# EAGLE schematic 240x240_v3 (EAGLE 9.6.2)
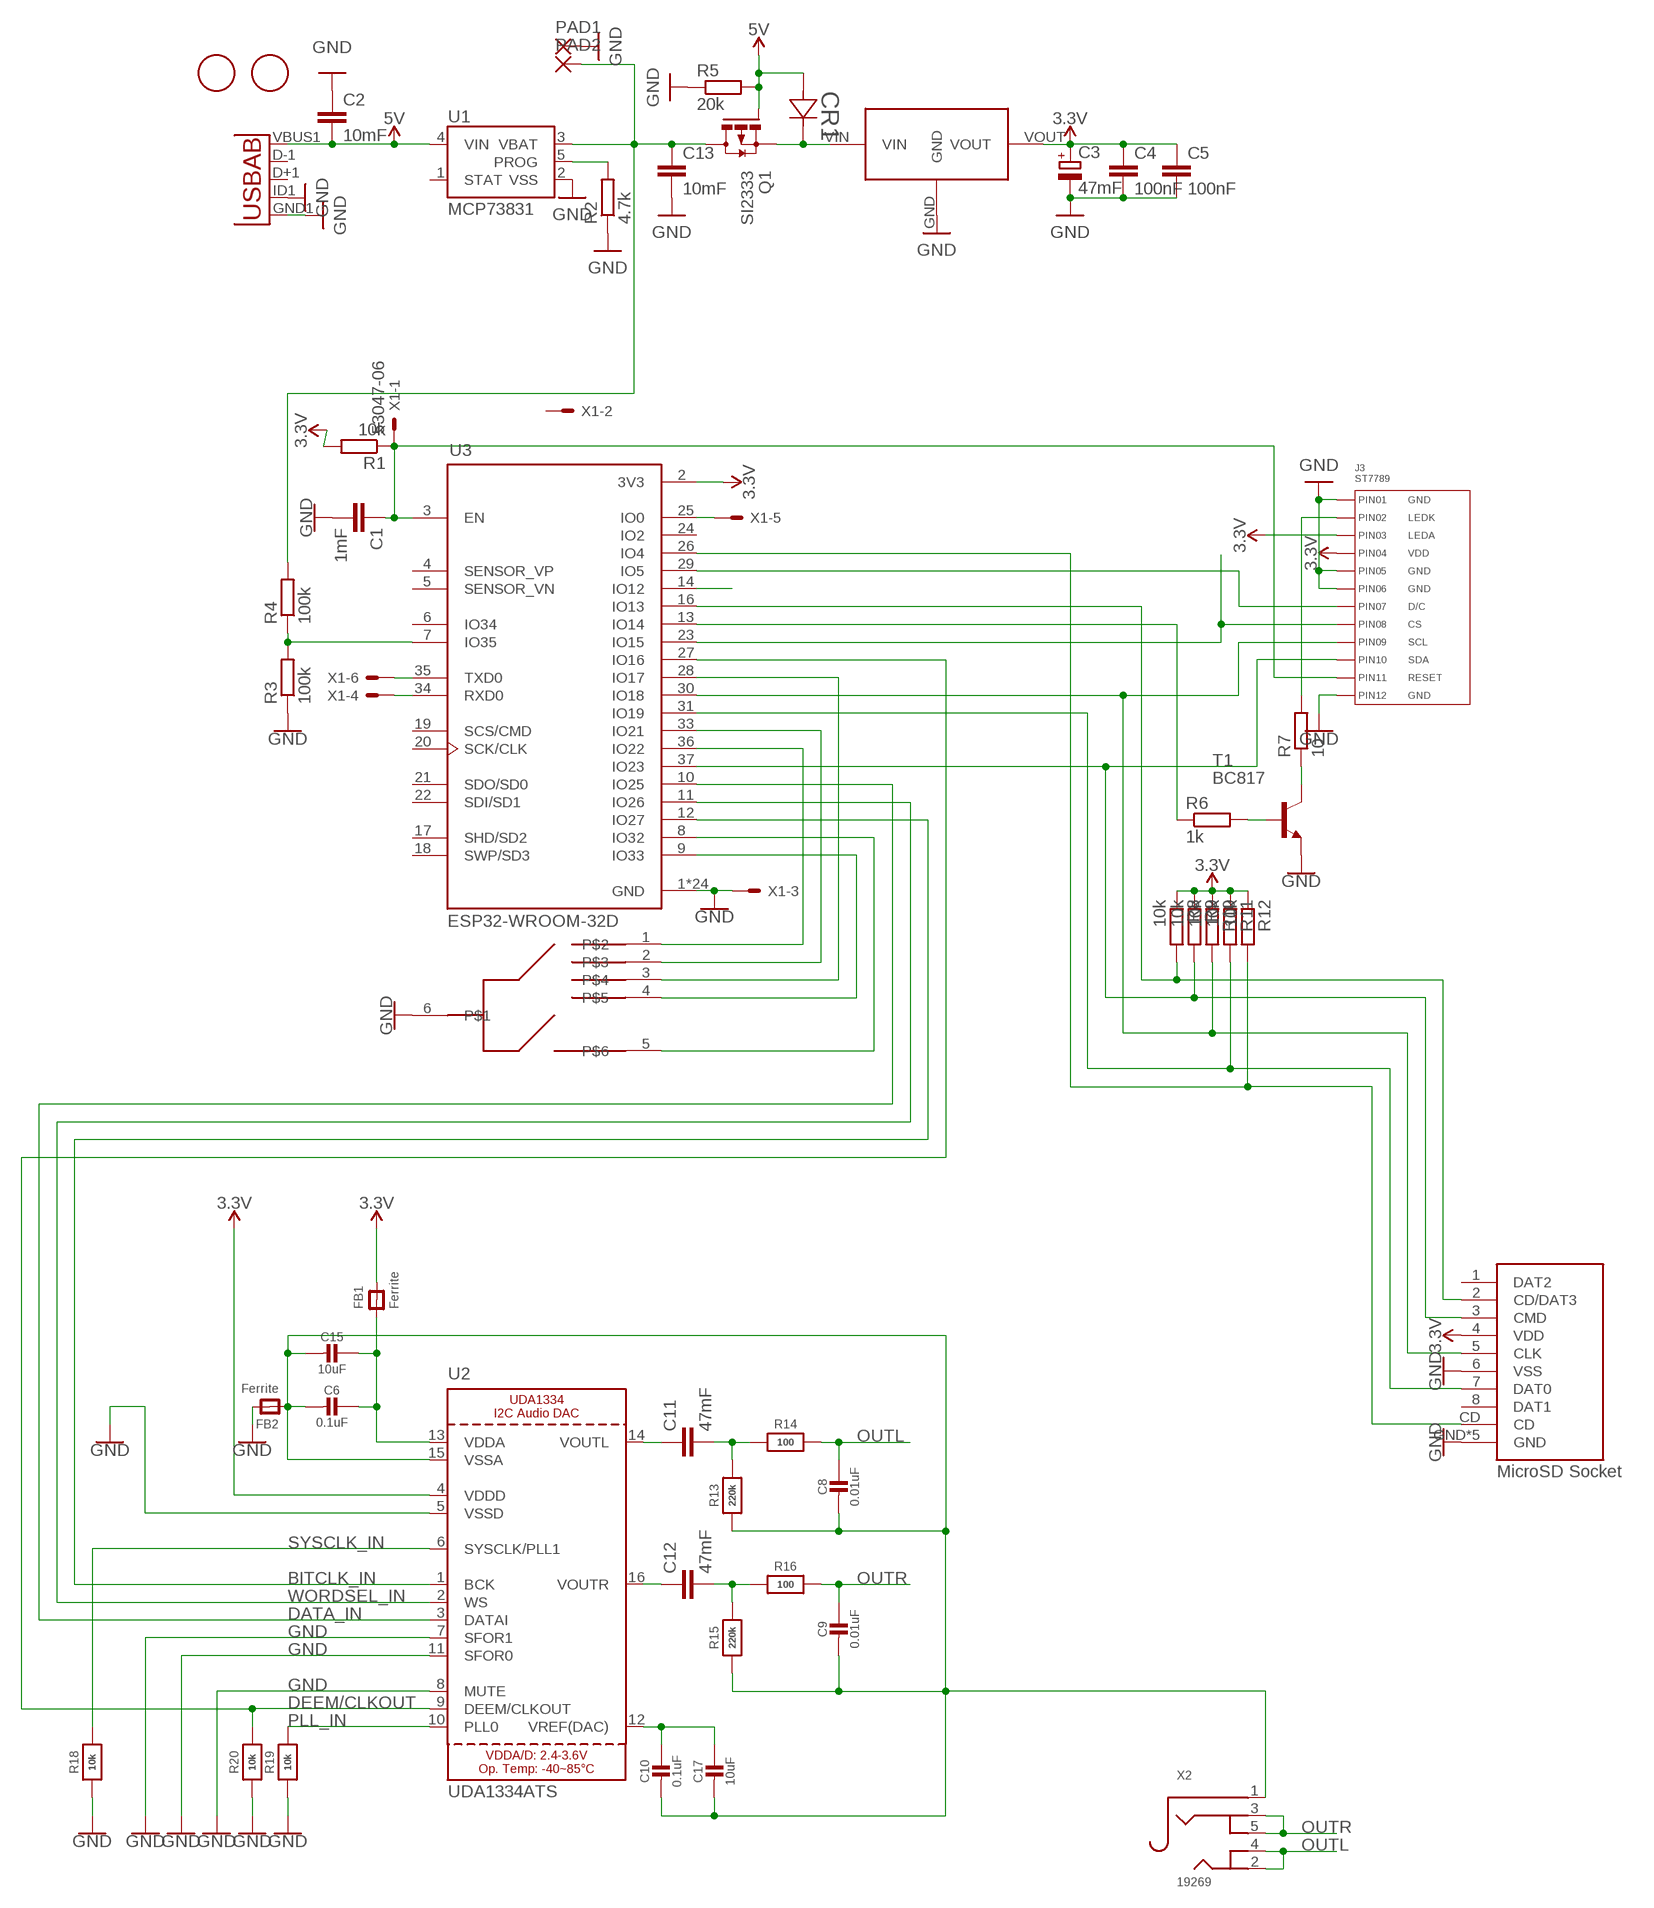
[diagram p0: schematic, sheet 1]

## Parts
C1  1mF  C-EUC0603  [C0603]
C2  10mF  C-EUC0603  [C0603]
C3  47mF  CPOL-EUSMCB  [SMC_B]
C4  100nF  C-EUC0805K  [C0805K]
C5  100nF  C-EUC0805K  [C0805K]
C6  0.1uF  CAP_CERAMIC0805-NOOUTLINE  [0805-NO]
C8  0.01uF  CAP_CERAMIC0805-NOOUTLINE  [0805-NO]
C9  0.01uF  CAP_CERAMIC0805-NOOUTLINE  [0805-NO]
C10  0.1uF  CAP_CERAMIC0805-NOOUTLINE  [0805-NO]
C11  47mF  C-EUC1210  [C1210]
C12  47mF  C-EUC1210  [C1210]
C13  10mF  C-EUC0603  [C0603]
C15  10uF  CAP_CERAMIC0805-NOOUTLINE  [0805-NO]
C17  10uF  CAP_CERAMIC0805-NOOUTLINE  [0805-NO]
CR1  BAT48  BAT48ZFILMSOD-123_STM-M  [SOD-123_STM-M]
FB1  Ferrite  FERRITE0805  [0805]
FB2  Ferrite  FERRITE0805  [0805]
J3  ST7789  CON_01X12_ST7789_CONNECTOR  [ST7789_CONNECTOR]
PAD1  SMD2  [SMD1,27-2,54]
PAD2  SMD2  [SMD1,27-2,54]
Q1  SI2333  FDN360P  [SUPER-SOT3]
R1  10k  R-EU_R0603  [R0603]
R2  4.7k  R-EU_R0603  [R0603]
R3  100k  R-EU_R0805  [R0805]
R4  100k  R-EU_R0805  [R0805]
R5  20k  R-EU_R0603  [R0603]
R6  1k  R-EU_R0603  [R0603]
R7  10  R-EU_R0805  [R0805]
R8  10k  R-EU_R0603  [R0603]
R9  10k  R-EU_R0603  [R0603]
R10  10k  R-EU_R0603  [R0603]
R11  10k  R-EU_R0603  [R0603]
R12  10k  R-EU_R0603  [R0603]
R13  220k  RESISTOR0805_NOOUTLINE  [0805-NO]
R14  100  RESISTOR0805_NOOUTLINE  [0805-NO]
R15  220k  RESISTOR0805_NOOUTLINE  [0805-NO]
R16  100  RESISTOR0805_NOOUTLINE  [0805-NO]
R18  10k  RESISTOR_0603_NOOUT  [0603-NO]
R19  10k  RESISTOR_0603_NOOUT  [0603-NO]
R20  10k  RESISTOR_0603_NOOUT  [0603-NO]
T1  BC817  BC817-16-NPN-SOT23-BEC  [SOT23-BEC]
U1  MCP73831  [SOT23-5]
U2  UDA1334ATS  AUDIO_I2S_UDA1334""  [SSOP16_4.4MM]
U3  ESP32-WROOM-32D  [MODULE_ESP32-WROOM-32D]
U4  USB""  [USB-MICRO-SMD]
U$1  XC6203  HT7333  [SOT89]
U$2  B5-P5S-0D  [B5-P5S-0D-Z]
U$3  FIDUCIAL  [FIDUCIAL_1MM]
U$4  FIDUCIAL  [FIDUCIAL_1MM]
U$5  ATTEND_MICROSD_SOCKET  [ATTEND_MICROSD_SOCKET]
X1  53047-06  [53047-06]
X2  19269  AUDIO_3.5MMJACK  [4UCONN_19269]

## Nets
3.3V [Power]: C3.+ C4.1 C5.1 FB1.2 J3.P$3 J3.P$4 R1.2 R8.1 R9.1 R10.1 R11.1 R12.1 U2.4(VDDD) U3.2(3V3) U$1.VOUT U$5.4(VDD)
5V [Power]: C2.2 CR1.1 Q1.1(G) R5.2 U1.4(VIN) U4.VBUS1(VBUS)
BITCLK_IN: U2.1(BCK) U3.12(IO27)
DATA_IN: U2.3(DATAI) U3.10(IO25)
DEEM/CLKOUT: R20.2 U2.9(DEEM/CLKOUT) U3.27(IO16)
GND [Power]: C1.2 C2.1 C3.- C4.2 C5.2 C13.2 FB2.2 J3.P$1 J3.P$5 J3.P$6 J3.P$12 PAD1.1(P) R2.1 R3.1 R5.1 R18.1 R19.1 R20.1 T1.E U1.2(VSS) U2.5(VSSD) U2.7(SFOR1) U2.8(MUTE) U2.11(SFOR0) U3.1(GND) U3.15(GND) U3.38(GND) U3.39_1(GND) U3.39_2(GND) U3.39_3(GND) U3.39_4(GND) U3.39_5(GND) U3.39_6(GND) U3.39_7(GND) U3.39_8(GND) U3.39_9(GND) U3.39_10(GND) U3.39_11(GND) U3.39_12(GND) U3.39_13(GND) U3.39_14(GND) U3.39_15(GND) U3.39_16(GND) U3.39_17(GND) U3.39_18(GND) U3.39_19(GND) U3.39_20(GND) U3.39_21(GND) U4.GND1(GND) U4.ID1(USBID) U$1.GND U$2.6 U$5.6(VSS) U$5.GND U$5.GND2(GND) U$5.GND3(GND) U$5.GND4(GND) U$5.GND5(GND) X1.3
N$1: C1.1 J3.P$11 R1.1 U3.3(EN) X1.1
N$2: J3.P$9 R10.2 U3.30(IO18) U$5.5(CLK)
N$3: J3.P$10 R9.2 U3.37(IO23) U$5.3(CMD)
N$4: U3.14(IO12)
N$5: J3.P$7 U3.29(IO5)
N$6: J3.P$8 U3.23(IO15)
N$7: U3.35(TXD0) X1.6
N$8: U3.34(RXD0) X1.4
N$9: R3.2 R4.1 U3.7(IO35)
N$10: R6.2 T1.B
N$11: U3.36(IO22) U$2.1
N$12: R2.2 U1.5(PROG)
N$13: J3.P$2 R7.2
N$14: U3.33(IO21) U$2.2
N$15: U3.28(IO17) U$2.3
N$16: U3.9(IO33) U$2.4
N$17: U3.8(IO32) U$2.5
N$18: R11.2 U3.31(IO19) U$5.7(DAT0)
N$19 [Power]: C13.1 PAD2.1(P) Q1.3(D) R4.2 U1.3(VBAT)
N$20: U3.25(IO0) X1.5
N$21: R7.1 T1.C
N$22: R6.1 U3.13(IO14)
N$23: R8.2 U3.16(IO13) U$5.2(CD/DAT3)
N$24: R12.2 U3.26(IO4) U$5.CD
N$25: C6.1 C15.1 FB1.1 U2.13(VDDA)
N$26: C11.2 R13.2 R14.1
N$27: C12.2 R15.2 R16.1
N$28: C10.1 C17.1 U2.12(VREF(DAC))
N$29: C12.1 U2.16(VOUTR)
N$30: C11.1 U2.14(VOUTL)
N$31: CR1.2 Q1.2(S) U$1.VIN
N$34: C6.2 C8.2 C9.2 C10.2 C15.2 C17.2 FB2.1 R13.1 R15.1 U2.15(VSSA) X2.1
OUTL: C8.1 R14.2 X2.2 X2.4
OUTR: C9.1 R16.2 X2.3 X2.5
PLL_IN: R19.2 U2.10(PLL0)
SYSCLK_IN: R18.2 U2.6(SYSCLK/PLL1)
WORDSEL_IN: U2.2(WS) U3.11(IO26)
Unconnected: U1.1(STAT) U3.4(SENSOR_VP) U3.5(SENSOR_VN) U3.6(IO34) U3.17(SHD/SD2) U3.18(SWP/SD3) U3.19(SCS/CMD) U3.20(SCK/CLK) U3.21(SDO/SD0) U3.22(SDI/SD1) U3.24(IO2) U4.D+1(D+) U4.D-1(D-) U$5.1(DAT2) U$5.8(DAT1) X1.2

## Library data of the parts
C1 C2 C4 C5 C11-C13 = rcl:C-EU: CAPACITOR, European symbol; SPICEPREFIX: C
C3 = rcl:CPOL-EU: POLARIZED CAPACITOR, European symbol; SPICEPREFIX: C
C6 C8-C10 C15 C17 = microbuilder:CAP_CERAMIC: Ceramic Capacitors For new designs, use the packages preceded by an '_' character since they are more reliable: The following footprints should be used on most boards: _0402 - Standard footprint for regular board layouts _0603 - Standard footprint for regular board layouts _0805 - Standard footprint for regular board layouts _1206 - Standard footprint for regular board layouts For extremely tight-pitch boards where space is at a premium, the following 'micro-pitch' footprints can be used (smaller pads, no silkscreen outline, etc.): _0402MP - Micro-pitch footprint for very dense/compact boards _0603MP - Micro-pitch footprint for very dense/compact boards _0805MP - Micro-pitch footprint for very dense/compact boards _1206MP - Micro-pitch footprint for very dense/compact boards
CR1 = BAT48:BAT48ZFILM; COPYRIGHT: Copyright (C) 2021 Ultra Librarian. All rights reserved.; MANUFACTURER_PART_NUMBER: BAT48ZFILM; MFR_NAME: STMicroelectronics
FB1 FB2 = microbuilder:FERRITE: Ferrite Bead 0603 MMZ1608B121C - 120 Ohm @ 100MHz, 600mA, 0.15 Ohm DC Resistance - Digikey: 445-2164-1-ND BK1608HW121-T - 120 Ohm, 600mA Ferrite Chip - Digikey: 587-1876-2-ND 0805 HZ0805B272R-10 - 2.7K Ohm @ 100MHz, 200mA, 0.8 Ohm DC Resistance - Digikey: 240-2504-1-ND (see also Murata BLM21BD272SN1L) MMZ2012Y152B - 1.5K Ohm @ 100MHz, 500mA, 0.4 Ohm DC Resistance - Digikey: 445-1560-1-ND - Mainly for high frequency (80-400MHz) MMZ2012R102A - 1K Ohm @ 100MHz, 500mA, 0.3 Ohm DC Resistance - Digikey: 445-1555-2-ND - More general purpose (10-200MHz)
J3 = PP_Connectors:CON_01X12; LABEL01: GND; LABEL02: LEDK; LABEL03: LEDA; LABEL04: VDD; LABEL05: GND; LABEL06: GND; LABEL07: D/C; LABEL08: CS; LABEL09: SCL; LABEL10: SDA; LABEL11: RESET; LABEL12: GND; POPULATE: 0
PAD1 PAD2 = wirepad:SMD2: SMD PAD
Q1 = transistor-power:FDN360P: Single P-Channel, PowerTrench (R) MOSFET Source: http://www.fairchildsemi.com/ds/FD/FDN360P.pdf
R1-R12 = rcl:R-EU_: RESISTOR, European symbol; SPICEPREFIX: R
R13-R16 R18-R20 = microbuilder:RESISTOR: Resistors For new designs, use the packages preceded by an '_' character since they are more reliable: The following footprints should be used on most boards: _0402 - Standard footprint for regular board layouts _0603 - Standard footprint for regular board layouts _0805 - Standard footprint for regular board layouts _1206 - Standard footprint for regular board layouts For extremely tight-pitch boards where space is at a premium, the following 'micro-pitch' footprints can be used (smaller pads, no silkscreen outline, etc.): _0402MP - Micro-pitch footprint for very dense/compact boards _0603MP - Micro-pitch footprint for very dense/compact boards _0805MP - Micro-pitch footprint for very dense/compact boards _1206MP - Micro-pitch footprint for very dense/compact boards
T1 = transistor:*-NPN-: NPN Transistror BF959 corrected 2008.03.06
U1 = SparkFun-IC-Power:MCP73831: MCP73831T Li-Ion, Li-Pol Controller Miniature single cell, fully integrated Li-Ion, Li-polymer charge management controller Datasheet <http://ww1.microchip.com/downloads/en/DeviceDoc/20001984g.pdf> SparkFun Products: SparkFun ESP32 Thing <https://www.sparkfun.com/products/13907> SparkFun 9DoF Razor IMU M0 <https://www.sparkfun.com/products/14001>; PROD_ID: IC-09995
U2 = microbuilder:AUDIO_I2S_UDA1334: UDA1334 I2C Audio DAC Power Supply: 2.4-3.6V Sample frequencies from 16-100kHz
U3 = ESP32-WROOM-32D_EDIT:ESP32-WROOM-32D: Bluetooth, WiFi 802.11b/g/n, Bluetooth v4.2 + EDR, Class 1, 2 and 3 Transceiver Module 2.4GHz ~ 2.5GHz Integrated, Trace Surface Mount Check prices <https://pricing.snapeda.com/parts/ESP32-WROOM-32D/Espressif%20Systems/view-part?ref=eda>; AVAILABILITY: Bad; DESCRIPTION: Bluetooth, WiFi 802.11b/g/n, Bluetooth v4.2 +EDR, Class 1, 2 and 3 Transceiver Module 2.4GHz ~ 2.5GHz Integrated, Trace Surface Mount; MF: Espressif Systems; MP: ESP32-WROOM-32D; PACKAGE: Module Espressif Systems; PRICE: None
U4 = MicroUSB:USB: This is a USB AB connector that is compatible with USB OTG. i.e. this connector can serve as a host or device
U$1 = HT7333_SOT89:HT7333
U$2 = zippy B5:B5-P5S-0D
U$3 U$4 = adafruit:FIDUCIAL: For use by pick and place machines to calibrate the vision/machine, 1mm By microbuilder.eu
U$5 = ATTEND MicroSD Card Socket:ATTEND_MICROSD_SOCKET
X1 = con-molex:53?-06: CONNECTOR wire to board 1.25 mm (.049 inch) pitch header; MF: MOLEX; MPN: 53047-0610-C; OC_FARNELL: 9733078; OC_NEWARK: 03M2965
X2 = microbuilder:AUDIO_3.5MMJACK: 3.5MM Audio Jack These are normally connected as follows, from left-to right on the schematic symbol above: Tip: Left Audio Inner Ring: Right Audio Shell: Common/GND

## Net classes
1 Power: width 0.406 mm